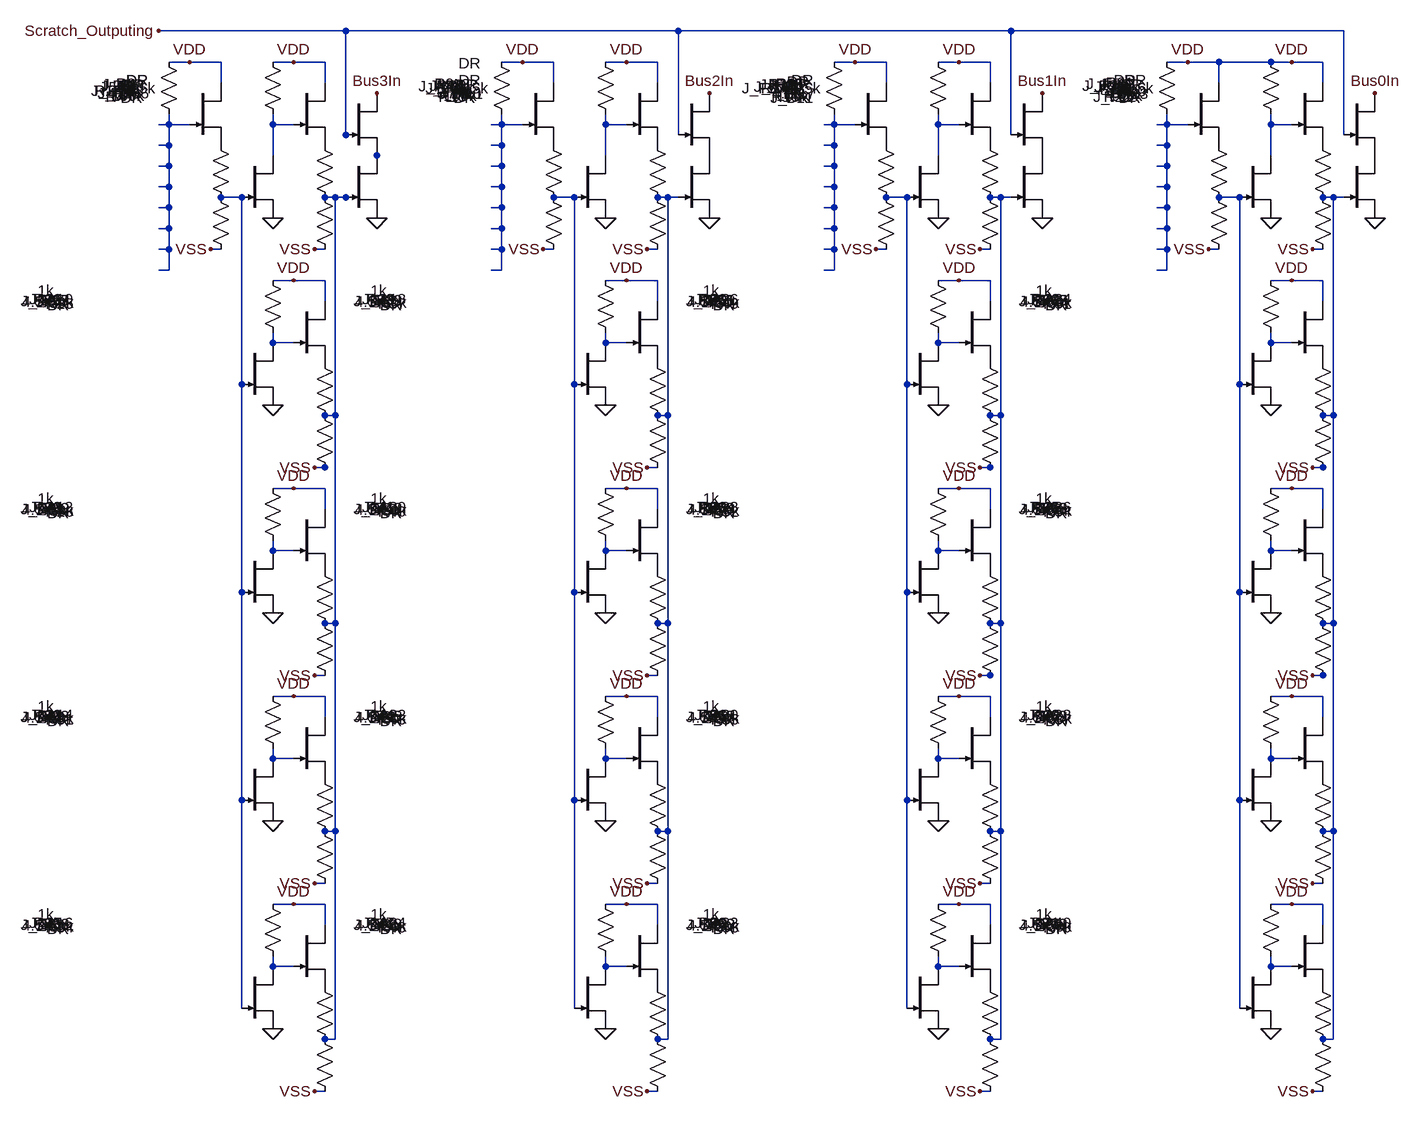
[diagram p0: schematic Bus1.asc]
Bus1.asc, the LTspice schematic file:
Version 4.1
SHEET 1 109444 42780
WIRE 40544 1168 40256 1168
WIRE 41056 1168 40544 1168
WIRE 41568 1168 41056 1168
WIRE 42080 1168 41568 1168
WIRE 40304 1216 40272 1216
WIRE 40352 1216 40304 1216
WIRE 40464 1216 40432 1216
WIRE 40512 1216 40464 1216
WIRE 40816 1216 40784 1216
WIRE 40864 1216 40816 1216
WIRE 40976 1216 40944 1216
WIRE 41024 1216 40976 1216
WIRE 41328 1216 41296 1216
WIRE 41376 1216 41328 1216
WIRE 41488 1216 41456 1216
WIRE 41536 1216 41488 1216
WIRE 41840 1216 41808 1216
WIRE 41888 1216 41840 1216
WIRE 41968 1216 41888 1216
WIRE 42000 1216 41968 1216
WIRE 42048 1216 42000 1216
WIRE 40352 1248 40352 1216
WIRE 40512 1248 40512 1216
WIRE 40864 1248 40864 1216
WIRE 41024 1248 41024 1216
WIRE 41376 1248 41376 1216
WIRE 41536 1248 41536 1216
WIRE 41888 1248 41888 1216
WIRE 42048 1248 42048 1216
WIRE 40272 1312 40272 1296
WIRE 40272 1312 40256 1312
WIRE 40304 1312 40272 1312
WIRE 40432 1312 40432 1296
WIRE 40464 1312 40432 1312
WIRE 40784 1312 40784 1296
WIRE 40784 1312 40768 1312
WIRE 40816 1312 40784 1312
WIRE 40944 1312 40944 1296
WIRE 40976 1312 40944 1312
WIRE 41296 1312 41296 1296
WIRE 41296 1312 41280 1312
WIRE 41328 1312 41296 1312
WIRE 41456 1312 41456 1296
WIRE 41488 1312 41456 1312
WIRE 41808 1312 41808 1296
WIRE 41808 1312 41792 1312
WIRE 41840 1312 41808 1312
WIRE 41968 1312 41968 1296
WIRE 42000 1312 41968 1312
WIRE 40544 1328 40544 1168
WIRE 41056 1328 41056 1168
WIRE 41568 1328 41568 1168
WIRE 42080 1328 42080 1168
WIRE 40272 1344 40272 1312
WIRE 40272 1344 40256 1344
WIRE 40784 1344 40784 1312
WIRE 40784 1344 40768 1344
WIRE 41296 1344 41296 1312
WIRE 41296 1344 41280 1344
WIRE 41808 1344 41808 1312
WIRE 41808 1344 41792 1344
WIRE 40432 1360 40432 1312
WIRE 40944 1360 40944 1312
WIRE 41456 1360 41456 1312
WIRE 41968 1360 41968 1312
WIRE 40272 1376 40272 1344
WIRE 40272 1376 40256 1376
WIRE 40784 1376 40784 1344
WIRE 40784 1376 40768 1376
WIRE 41296 1376 41296 1344
WIRE 41296 1376 41280 1376
WIRE 41808 1376 41808 1344
WIRE 41808 1376 41792 1376
WIRE 40272 1408 40272 1376
WIRE 40272 1408 40256 1408
WIRE 40784 1408 40784 1376
WIRE 40784 1408 40768 1408
WIRE 41296 1408 41296 1376
WIRE 41296 1408 41280 1408
WIRE 41808 1408 41808 1376
WIRE 41808 1408 41792 1408
WIRE 40384 1424 40352 1424
WIRE 40528 1424 40512 1424
WIRE 40544 1424 40528 1424
WIRE 40896 1424 40864 1424
WIRE 41040 1424 41024 1424
WIRE 41056 1424 41040 1424
WIRE 41408 1424 41376 1424
WIRE 41552 1424 41536 1424
WIRE 41568 1424 41552 1424
WIRE 41920 1424 41888 1424
WIRE 42064 1424 42048 1424
WIRE 42080 1424 42064 1424
WIRE 40272 1440 40272 1408
WIRE 40272 1440 40256 1440
WIRE 40784 1440 40784 1408
WIRE 40784 1440 40768 1440
WIRE 41296 1440 41296 1408
WIRE 41296 1440 41280 1440
WIRE 41808 1440 41808 1408
WIRE 41808 1440 41792 1440
WIRE 40272 1472 40272 1440
WIRE 40272 1472 40256 1472
WIRE 40784 1472 40784 1440
WIRE 40784 1472 40768 1472
WIRE 41296 1472 41296 1440
WIRE 41296 1472 41280 1472
WIRE 41808 1472 41808 1440
WIRE 41808 1472 41792 1472
WIRE 40272 1504 40272 1472
WIRE 40272 1504 40256 1504
WIRE 40352 1504 40336 1504
WIRE 40512 1504 40496 1504
WIRE 40784 1504 40784 1472
WIRE 40784 1504 40768 1504
WIRE 40864 1504 40848 1504
WIRE 41024 1504 41008 1504
WIRE 41296 1504 41296 1472
WIRE 41296 1504 41280 1504
WIRE 41376 1504 41360 1504
WIRE 41536 1504 41520 1504
WIRE 41808 1504 41808 1472
WIRE 41808 1504 41792 1504
WIRE 41888 1504 41872 1504
WIRE 42048 1504 42032 1504
WIRE 40272 1536 40272 1504
WIRE 40272 1536 40256 1536
WIRE 40784 1536 40784 1504
WIRE 40784 1536 40768 1536
WIRE 41296 1536 41296 1504
WIRE 41296 1536 41280 1536
WIRE 41808 1536 41808 1504
WIRE 41808 1536 41792 1536
WIRE 40464 1552 40432 1552
WIRE 40512 1552 40464 1552
WIRE 40976 1552 40944 1552
WIRE 41024 1552 40976 1552
WIRE 41488 1552 41456 1552
WIRE 41536 1552 41488 1552
WIRE 42000 1552 41968 1552
WIRE 42048 1552 42000 1552
WIRE 40512 1584 40512 1552
WIRE 41024 1584 41024 1552
WIRE 41536 1584 41536 1552
WIRE 42048 1584 42048 1552
WIRE 40432 1648 40432 1632
WIRE 40464 1648 40432 1648
WIRE 40944 1648 40944 1632
WIRE 40976 1648 40944 1648
WIRE 41456 1648 41456 1632
WIRE 41488 1648 41456 1648
WIRE 41968 1648 41968 1632
WIRE 42000 1648 41968 1648
WIRE 40384 1712 40384 1424
WIRE 40896 1712 40896 1424
WIRE 41408 1712 41408 1424
WIRE 41920 1712 41920 1424
WIRE 40528 1760 40528 1424
WIRE 40528 1760 40512 1760
WIRE 41040 1760 41040 1424
WIRE 41040 1760 41024 1760
WIRE 41552 1760 41552 1424
WIRE 41552 1760 41536 1760
WIRE 42064 1760 42064 1424
WIRE 42064 1760 42048 1760
WIRE 40512 1840 40496 1840
WIRE 41024 1840 41008 1840
WIRE 41536 1840 41520 1840
WIRE 42048 1840 42032 1840
WIRE 40464 1872 40432 1872
WIRE 40512 1872 40464 1872
WIRE 40976 1872 40944 1872
WIRE 41024 1872 40976 1872
WIRE 41488 1872 41456 1872
WIRE 41536 1872 41488 1872
WIRE 42000 1872 41968 1872
WIRE 42048 1872 42000 1872
WIRE 40512 1904 40512 1872
WIRE 41024 1904 41024 1872
WIRE 41536 1904 41536 1872
WIRE 42048 1904 42048 1872
WIRE 40432 1968 40432 1952
WIRE 40464 1968 40432 1968
WIRE 40944 1968 40944 1952
WIRE 40976 1968 40944 1968
WIRE 41456 1968 41456 1952
WIRE 41488 1968 41456 1968
WIRE 41968 1968 41968 1952
WIRE 42000 1968 41968 1968
WIRE 40384 2032 40384 1712
WIRE 40896 2032 40896 1712
WIRE 41408 2032 41408 1712
WIRE 41920 2032 41920 1712
WIRE 40528 2080 40528 1760
WIRE 40528 2080 40512 2080
WIRE 41040 2080 41040 1760
WIRE 41040 2080 41024 2080
WIRE 41552 2080 41552 1760
WIRE 41552 2080 41536 2080
WIRE 42064 2080 42064 1760
WIRE 42064 2080 42048 2080
WIRE 40512 2160 40496 2160
WIRE 41024 2160 41008 2160
WIRE 41536 2160 41520 2160
WIRE 42048 2160 42032 2160
WIRE 40464 2192 40432 2192
WIRE 40512 2192 40464 2192
WIRE 40976 2192 40944 2192
WIRE 41024 2192 40976 2192
WIRE 41488 2192 41456 2192
WIRE 41536 2192 41488 2192
WIRE 42000 2192 41968 2192
WIRE 42048 2192 42000 2192
WIRE 40512 2224 40512 2192
WIRE 41024 2224 41024 2192
WIRE 41536 2224 41536 2192
WIRE 42048 2224 42048 2192
WIRE 40432 2288 40432 2272
WIRE 40464 2288 40432 2288
WIRE 40944 2288 40944 2272
WIRE 40976 2288 40944 2288
WIRE 41456 2288 41456 2272
WIRE 41488 2288 41456 2288
WIRE 41968 2288 41968 2272
WIRE 42000 2288 41968 2288
WIRE 40384 2352 40384 2032
WIRE 40896 2352 40896 2032
WIRE 41408 2352 41408 2032
WIRE 41920 2352 41920 2032
WIRE 40528 2400 40528 2080
WIRE 40528 2400 40512 2400
WIRE 41040 2400 41040 2080
WIRE 41040 2400 41024 2400
WIRE 41552 2400 41552 2080
WIRE 41552 2400 41536 2400
WIRE 42064 2400 42064 2080
WIRE 42064 2400 42048 2400
WIRE 40512 2480 40496 2480
WIRE 41024 2480 41008 2480
WIRE 41536 2480 41520 2480
WIRE 42048 2480 42032 2480
WIRE 40464 2512 40432 2512
WIRE 40512 2512 40464 2512
WIRE 40976 2512 40944 2512
WIRE 41024 2512 40976 2512
WIRE 41488 2512 41456 2512
WIRE 41536 2512 41488 2512
WIRE 42000 2512 41968 2512
WIRE 42048 2512 42000 2512
WIRE 40512 2544 40512 2512
WIRE 41024 2544 41024 2512
WIRE 41536 2544 41536 2512
WIRE 42048 2544 42048 2512
WIRE 40432 2608 40432 2592
WIRE 40464 2608 40432 2608
WIRE 40944 2608 40944 2592
WIRE 40976 2608 40944 2608
WIRE 41456 2608 41456 2592
WIRE 41488 2608 41456 2608
WIRE 41968 2608 41968 2592
WIRE 42000 2608 41968 2608
WIRE 40384 2672 40384 2352
WIRE 40896 2672 40896 2352
WIRE 41408 2672 41408 2352
WIRE 41920 2672 41920 2352
WIRE 40528 2720 40528 2400
WIRE 40528 2720 40512 2720
WIRE 41040 2720 41040 2400
WIRE 41040 2720 41024 2720
WIRE 41552 2720 41552 2400
WIRE 41552 2720 41536 2720
WIRE 42064 2720 42064 2400
WIRE 42064 2720 42048 2720
WIRE 40512 2800 40496 2800
WIRE 41024 2800 41008 2800
WIRE 41536 2800 41520 2800
WIRE 42048 2800 42032 2800
FLAG 40256 1168 Scratch_Outputing
FLAG 40304 1216 VDD
FLAG 40464 1216 VDD
FLAG 40336 1504 VSS
FLAG 40496 1504 VSS
FLAG 40432 1456 0
FLAG 40592 1456 0
FLAG 40816 1216 VDD
FLAG 40976 1216 VDD
FLAG 40848 1504 VSS
FLAG 41008 1504 VSS
FLAG 40944 1456 0
FLAG 41104 1456 0
FLAG 41328 1216 VDD
FLAG 41488 1216 VDD
FLAG 41360 1504 VSS
FLAG 41520 1504 VSS
FLAG 41456 1456 0
FLAG 41616 1456 0
FLAG 41840 1216 VDD
FLAG 42000 1216 VDD
FLAG 41872 1504 VSS
FLAG 42032 1504 VSS
FLAG 41968 1456 0
FLAG 42128 1456 0
FLAG 40592 1264 Bus3In
FLAG 41104 1264 Bus2In
FLAG 41616 1264 Bus1In
FLAG 42128 1264 Bus0In
FLAG 40464 1552 VDD
FLAG 40496 1840 VSS
FLAG 40432 1744 0
FLAG 40464 1872 VDD
FLAG 40496 2160 VSS
FLAG 40432 2064 0
FLAG 40464 2192 VDD
FLAG 40496 2480 VSS
FLAG 40432 2384 0
FLAG 40464 2512 VDD
FLAG 40496 2800 VSS
FLAG 40432 2704 0
FLAG 40976 1552 VDD
FLAG 41008 1840 VSS
FLAG 40944 1744 0
FLAG 40976 1872 VDD
FLAG 41008 2160 VSS
FLAG 40944 2064 0
FLAG 40976 2192 VDD
FLAG 41008 2480 VSS
FLAG 40944 2384 0
FLAG 40976 2512 VDD
FLAG 41008 2800 VSS
FLAG 40944 2704 0
FLAG 41488 1552 VDD
FLAG 41520 1840 VSS
FLAG 41456 1744 0
FLAG 41488 1872 VDD
FLAG 41520 2160 VSS
FLAG 41456 2064 0
FLAG 41488 2192 VDD
FLAG 41520 2480 VSS
FLAG 41456 2384 0
FLAG 41488 2512 VDD
FLAG 41520 2800 VSS
FLAG 41456 2704 0
FLAG 42000 1552 VDD
FLAG 42032 1840 VSS
FLAG 41968 1744 0
FLAG 42000 1872 VDD
FLAG 42032 2160 VSS
FLAG 41968 2064 0
FLAG 42000 2192 VDD
FLAG 42032 2480 VSS
FLAG 41968 2384 0
FLAG 42000 2512 VDD
FLAG 42032 2800 VSS
FLAG 41968 2704 0
SYMBOL njf 40544 1360 R0
WINDOW 0 -376 -108 Left 2
WINDOW 3 -338 -116 Left 2
SYMATTR InstName J_F59
SYMATTR Value DR
SYMBOL njf 40544 1264 R0
WINDOW 0 -382 0 Left 2
WINDOW 3 -360 4 Left 2
SYMATTR InstName J_F266
SYMATTR Value DR
SYMBOL res 40528 1856 R180
WINDOW 0 408 274 Left 2
WINDOW 3 436 271 Left 2
SYMATTR InstName R93
SYMATTR Value 4.5k
SYMBOL njf 40384 1968 R0
WINDOW 0 -340 -64 Left 2
WINDOW 3 -315 -65 Left 2
SYMATTR InstName J_A94
SYMATTR Value DR
SYMBOL njf 40384 2288 R0
WINDOW 0 -340 -64 Left 2
WINDOW 3 -315 -65 Left 2
SYMATTR InstName J_A98
SYMATTR Value DR
SYMBOL res 41552 1856 R180
WINDOW 0 408 274 Left 2
WINDOW 3 436 271 Left 2
SYMATTR InstName R955
SYMATTR Value 4.5k
SYMBOL res 41552 2176 R180
WINDOW 0 408 274 Left 2
WINDOW 3 436 271 Left 2
SYMATTR InstName R958
SYMATTR Value 4.5k
SYMBOL res 42064 1856 R180
WINDOW 0 408 274 Left 2
WINDOW 3 436 271 Left 2
SYMATTR InstName R967
SYMATTR Value 4.5k
SYMBOL res 42064 2176 R180
WINDOW 0 408 274 Left 2
WINDOW 3 436 271 Left 2
SYMATTR InstName R970
SYMATTR Value 4.5k
SYMBOL res 40256 1200 R0
WINDOW 0 -99 60 Left 2
WINDOW 3 -73 68 Left 2
SYMATTR InstName R1
SYMATTR Value 100k
SYMBOL njf 40304 1248 R0
WINDOW 0 -152 12 Left 2
WINDOW 3 -106 23 Left 2
SYMATTR InstName J_F1
SYMATTR Value DR
SYMBOL res 40336 1328 R0
WINDOW 0 -139 -67 Left 2
WINDOW 3 -141 -74 Left 2
SYMATTR InstName R2
SYMATTR Value 1k
SYMBOL res 40336 1408 R0
WINDOW 0 -145 -159 Left 2
WINDOW 3 -159 -144 Left 2
SYMATTR InstName R3
SYMATTR Value 4.8k
SYMBOL njf 40384 1360 R0
WINDOW 0 -215 -110 Left 2
WINDOW 3 -183 -109 Left 2
SYMATTR InstName J_A1
SYMATTR Value DR
SYMBOL res 40416 1200 R0
WINDOW 0 -241 69 Left 2
WINDOW 3 -237 55 Left 2
SYMATTR InstName R4
SYMATTR Value 50k
SYMBOL njf 40464 1248 R0
WINDOW 0 -299 7 Left 2
WINDOW 3 -270 17 Left 2
SYMATTR InstName J_A2
SYMATTR Value DR
SYMBOL res 40496 1328 R0
WINDOW 0 -308 -67 Left 2
WINDOW 3 -292 -72 Left 2
SYMATTR InstName R5
SYMATTR Value 1k
SYMBOL res 40528 1520 R180
WINDOW 0 312 268 Left 2
WINDOW 3 276 264 Left 2
SYMATTR InstName R6
SYMATTR Value 4.5k
SYMBOL njf 40544 1360 R0
WINDOW 0 -376 -108 Left 2
WINDOW 3 -338 -116 Left 2
SYMATTR InstName J_F2
SYMATTR Value DR
SYMBOL res 40768 1200 R0
WINDOW 0 -84 62 Left 2
WINDOW 3 -73 68 Left 2
SYMATTR InstName R7
SYMATTR Value 100k
SYMBOL njf 40816 1248 R0
WINDOW 0 -149 8 Left 2
WINDOW 3 -106 23 Left 2
SYMATTR InstName J_F3
SYMATTR Value DR
SYMBOL res 40848 1328 R0
WINDOW 0 -139 -67 Left 2
WINDOW 3 -141 -74 Left 2
SYMATTR InstName R8
SYMATTR Value 1k
SYMBOL res 40848 1408 R0
WINDOW 0 -167 -159 Left 2
WINDOW 3 -159 -144 Left 2
SYMATTR InstName R9
SYMATTR Value 4.8k
SYMBOL njf 40896 1360 R0
WINDOW 0 -215 -110 Left 2
WINDOW 3 -183 -109 Left 2
SYMATTR InstName J_A3
SYMATTR Value DR
SYMBOL res 40928 1200 R0
WINDOW 0 -241 69 Left 2
WINDOW 3 -237 55 Left 2
SYMATTR InstName R10
SYMATTR Value 50k
SYMBOL njf 40976 1248 R0
WINDOW 0 -320 5 Left 2
WINDOW 3 -270 17 Left 2
SYMATTR InstName J_A4
SYMATTR Value DR
SYMBOL res 41008 1328 R0
WINDOW 0 -296 -63 Left 2
WINDOW 3 -292 -72 Left 2
SYMATTR InstName R11
SYMATTR Value 1k
SYMBOL res 41040 1520 R180
WINDOW 0 312 268 Left 2
WINDOW 3 276 264 Left 2
SYMATTR InstName R12
SYMATTR Value 4.5k
SYMBOL njf 41056 1360 R0
WINDOW 0 -383 -108 Left 2
WINDOW 3 -338 -116 Left 2
SYMATTR InstName J_F4
SYMATTR Value DR
SYMBOL res 41280 1200 R0
WINDOW 0 -85 50 Left 2
WINDOW 3 -73 68 Left 2
SYMATTR InstName R13
SYMATTR Value 100k
SYMBOL njf 41328 1248 R0
WINDOW 0 -174 8 Left 2
WINDOW 3 -106 23 Left 2
SYMATTR InstName J_F5
SYMATTR Value DR
SYMBOL res 41360 1328 R0
WINDOW 0 -177 -72 Left 2
WINDOW 3 -141 -74 Left 2
SYMATTR InstName R14
SYMATTR Value 1k
SYMBOL res 41360 1408 R0
WINDOW 0 -154 -159 Left 2
WINDOW 3 -159 -144 Left 2
SYMATTR InstName R15
SYMATTR Value 4.8k
SYMBOL njf 41408 1360 R0
WINDOW 0 -215 -110 Left 2
WINDOW 3 -183 -109 Left 2
SYMATTR InstName J_A5
SYMATTR Value DR
SYMBOL res 41440 1200 R0
WINDOW 0 -241 69 Left 2
WINDOW 3 -237 55 Left 2
SYMATTR InstName R16
SYMATTR Value 50k
SYMBOL njf 41488 1248 R0
WINDOW 0 -316 6 Left 2
WINDOW 3 -270 17 Left 2
SYMATTR InstName J_A6
SYMATTR Value DR
SYMBOL res 41520 1328 R0
WINDOW 0 -296 -63 Left 2
WINDOW 3 -292 -72 Left 2
SYMATTR InstName R17
SYMATTR Value 1k
SYMBOL res 41552 1520 R180
WINDOW 0 312 268 Left 2
WINDOW 3 276 264 Left 2
SYMATTR InstName R18
SYMATTR Value 4.5k
SYMBOL njf 41568 1360 R0
WINDOW 0 -387 -109 Left 2
WINDOW 3 -338 -116 Left 2
SYMATTR InstName J_F6
SYMATTR Value DR
SYMBOL res 41792 1200 R0
WINDOW 0 -87 58 Left 2
WINDOW 3 -73 68 Left 2
SYMATTR InstName R19
SYMATTR Value 100k
SYMBOL njf 41840 1248 R0
WINDOW 0 -162 4 Left 2
WINDOW 3 -106 23 Left 2
SYMATTR InstName J_F7
SYMATTR Value DR
SYMBOL res 41872 1328 R0
WINDOW 0 -139 -67 Left 2
WINDOW 3 -141 -74 Left 2
SYMATTR InstName R20
SYMATTR Value 1k
SYMBOL res 41872 1408 R0
WINDOW 0 -158 -160 Left 2
WINDOW 3 -159 -144 Left 2
SYMATTR InstName R21
SYMATTR Value 4.8k
SYMBOL njf 41920 1360 R0
WINDOW 0 -215 -110 Left 2
WINDOW 3 -183 -109 Left 2
SYMATTR InstName J_A7
SYMATTR Value DR
SYMBOL res 41952 1200 R0
WINDOW 0 -241 69 Left 2
WINDOW 3 -237 55 Left 2
SYMATTR InstName R22
SYMATTR Value 50k
SYMBOL njf 42000 1248 R0
WINDOW 0 -304 6 Left 2
WINDOW 3 -270 17 Left 2
SYMATTR InstName J_A8
SYMATTR Value DR
SYMBOL res 42032 1328 R0
WINDOW 0 -296 -63 Left 2
WINDOW 3 -292 -72 Left 2
SYMATTR InstName R23
SYMATTR Value 1k
SYMBOL res 42064 1520 R180
WINDOW 0 312 268 Left 2
WINDOW 3 276 264 Left 2
SYMATTR InstName R24
SYMATTR Value 4.5k
SYMBOL njf 42080 1360 R0
WINDOW 0 -396 -111 Left 2
WINDOW 3 -338 -116 Left 2
SYMATTR InstName J_F8
SYMATTR Value DR
SYMBOL njf 40544 1264 R0
WINDOW 0 -382 0 Left 2
WINDOW 3 -360 4 Left 2
SYMATTR InstName J_F9
SYMATTR Value DR
SYMBOL njf 41056 1264 R0
WINDOW 0 -369 1 Left 2
WINDOW 3 -338 -46 Left 2
SYMATTR InstName J_F10
SYMATTR Value DR
SYMBOL njf 41568 1264 R0
WINDOW 0 -370 7 Left 2
WINDOW 3 -345 -18 Left 2
SYMATTR InstName J_F11
SYMATTR Value DR
SYMBOL njf 42080 1264 R0
WINDOW 0 -385 5 Left 2
WINDOW 3 -354 -20 Left 2
SYMATTR InstName J_F12
SYMATTR Value DR
SYMBOL njf 40384 1648 R0
WINDOW 0 -340 -64 Left 2
WINDOW 3 -315 -65 Left 2
SYMATTR InstName J_A9
SYMATTR Value DR
SYMBOL res 40416 1536 R0
WINDOW 0 -334 52 Left 2
WINDOW 3 -328 50 Left 2
SYMATTR InstName R25
SYMATTR Value 50k
SYMBOL njf 40464 1584 R0
WINDOW 0 -407 -3 Left 2
WINDOW 3 -379 6 Left 2
SYMATTR InstName J_A10
SYMATTR Value DR
SYMBOL res 40496 1664 R0
WINDOW 0 -432 -83 Left 2
WINDOW 3 -426 -96 Left 2
SYMATTR InstName R26
SYMATTR Value 1k
SYMBOL res 40528 1856 R180
WINDOW 0 408 274 Left 2
WINDOW 3 436 271 Left 2
SYMATTR InstName R27
SYMATTR Value 4.5k
SYMBOL njf 40384 1968 R0
WINDOW 0 -340 -64 Left 2
WINDOW 3 -315 -65 Left 2
SYMATTR InstName J_A11
SYMATTR Value DR
SYMBOL res 40416 1856 R0
WINDOW 0 -334 52 Left 2
WINDOW 3 -328 50 Left 2
SYMATTR InstName R28
SYMATTR Value 50k
SYMBOL njf 40464 1904 R0
WINDOW 0 -407 -3 Left 2
WINDOW 3 -379 6 Left 2
SYMATTR InstName J_A12
SYMATTR Value DR
SYMBOL res 40496 1984 R0
WINDOW 0 -432 -83 Left 2
WINDOW 3 -426 -96 Left 2
SYMATTR InstName R29
SYMATTR Value 1k
SYMBOL res 40528 2176 R180
WINDOW 0 408 274 Left 2
WINDOW 3 436 271 Left 2
SYMATTR InstName R30
SYMATTR Value 4.5k
SYMBOL njf 40384 2288 R0
WINDOW 0 -340 -64 Left 2
WINDOW 3 -315 -65 Left 2
SYMATTR InstName J_A13
SYMATTR Value DR
SYMBOL res 40416 2176 R0
WINDOW 0 -334 52 Left 2
WINDOW 3 -328 50 Left 2
SYMATTR InstName R31
SYMATTR Value 50k
SYMBOL njf 40464 2224 R0
WINDOW 0 -407 -3 Left 2
WINDOW 3 -379 6 Left 2
SYMATTR InstName J_A14
SYMATTR Value DR
SYMBOL res 40496 2304 R0
WINDOW 0 -432 -83 Left 2
WINDOW 3 -426 -96 Left 2
SYMATTR InstName R32
SYMATTR Value 1k
SYMBOL res 40528 2496 R180
WINDOW 0 408 274 Left 2
WINDOW 3 436 271 Left 2
SYMATTR InstName R33
SYMATTR Value 4.5k
SYMBOL njf 40384 2608 R0
WINDOW 0 -340 -64 Left 2
WINDOW 3 -315 -65 Left 2
SYMATTR InstName J_A15
SYMATTR Value DR
SYMBOL res 40416 2496 R0
WINDOW 0 -334 52 Left 2
WINDOW 3 -328 50 Left 2
SYMATTR InstName R34
SYMATTR Value 50k
SYMBOL njf 40464 2544 R0
WINDOW 0 -407 -3 Left 2
WINDOW 3 -379 6 Left 2
SYMATTR InstName J_A16
SYMATTR Value DR
SYMBOL res 40496 2624 R0
WINDOW 0 -432 -83 Left 2
WINDOW 3 -426 -96 Left 2
SYMATTR InstName R35
SYMATTR Value 1k
SYMBOL res 40528 2816 R180
WINDOW 0 408 274 Left 2
WINDOW 3 436 271 Left 2
SYMATTR InstName R36
SYMATTR Value 4.5k
SYMBOL njf 40896 1648 R0
WINDOW 0 -340 -64 Left 2
WINDOW 3 -315 -65 Left 2
SYMATTR InstName J_A17
SYMATTR Value DR
SYMBOL res 40928 1536 R0
WINDOW 0 -334 52 Left 2
WINDOW 3 -328 50 Left 2
SYMATTR InstName R37
SYMATTR Value 50k
SYMBOL njf 40976 1584 R0
WINDOW 0 -407 -3 Left 2
WINDOW 3 -379 6 Left 2
SYMATTR InstName J_A18
SYMATTR Value DR
SYMBOL res 41008 1664 R0
WINDOW 0 -432 -83 Left 2
WINDOW 3 -426 -96 Left 2
SYMATTR InstName R38
SYMATTR Value 1k
SYMBOL res 41040 1856 R180
WINDOW 0 408 274 Left 2
WINDOW 3 436 271 Left 2
SYMATTR InstName R39
SYMATTR Value 4.5k
SYMBOL njf 40896 1968 R0
WINDOW 0 -340 -64 Left 2
WINDOW 3 -315 -65 Left 2
SYMATTR InstName J_A19
SYMATTR Value DR
SYMBOL res 40928 1856 R0
WINDOW 0 -334 52 Left 2
WINDOW 3 -328 50 Left 2
SYMATTR InstName R40
SYMATTR Value 50k
SYMBOL njf 40976 1904 R0
WINDOW 0 -407 -3 Left 2
WINDOW 3 -379 6 Left 2
SYMATTR InstName J_A20
SYMATTR Value DR
SYMBOL res 41008 1984 R0
WINDOW 0 -432 -83 Left 2
WINDOW 3 -426 -96 Left 2
SYMATTR InstName R41
SYMATTR Value 1k
SYMBOL res 41040 2176 R180
WINDOW 0 408 274 Left 2
WINDOW 3 436 271 Left 2
SYMATTR InstName R42
SYMATTR Value 4.5k
SYMBOL njf 40896 2288 R0
WINDOW 0 -340 -64 Left 2
WINDOW 3 -315 -65 Left 2
SYMATTR InstName J_A21
SYMATTR Value DR
SYMBOL res 40928 2176 R0
WINDOW 0 -334 52 Left 2
WINDOW 3 -328 50 Left 2
SYMATTR InstName R43
SYMATTR Value 50k
SYMBOL njf 40976 2224 R0
WINDOW 0 -407 -3 Left 2
WINDOW 3 -379 6 Left 2
SYMATTR InstName J_A22
SYMATTR Value DR
SYMBOL res 41008 2304 R0
WINDOW 0 -432 -83 Left 2
WINDOW 3 -426 -96 Left 2
SYMATTR InstName R44
SYMATTR Value 1k
SYMBOL res 41040 2496 R180
WINDOW 0 408 274 Left 2
WINDOW 3 436 271 Left 2
SYMATTR InstName R45
SYMATTR Value 4.5k
SYMBOL njf 40896 2608 R0
WINDOW 0 -340 -64 Left 2
WINDOW 3 -315 -65 Left 2
SYMATTR InstName J_A23
SYMATTR Value DR
SYMBOL res 40928 2496 R0
WINDOW 0 -334 52 Left 2
WINDOW 3 -328 50 Left 2
SYMATTR InstName R46
SYMATTR Value 50k
SYMBOL njf 40976 2544 R0
WINDOW 0 -407 -3 Left 2
WINDOW 3 -379 6 Left 2
SYMATTR InstName J_A24
SYMATTR Value DR
SYMBOL res 41008 2624 R0
WINDOW 0 -432 -83 Left 2
WINDOW 3 -426 -96 Left 2
SYMATTR InstName R47
SYMATTR Value 1k
SYMBOL res 41040 2816 R180
WINDOW 0 408 274 Left 2
WINDOW 3 436 271 Left 2
SYMATTR InstName R48
SYMATTR Value 4.5k
SYMBOL njf 41408 1648 R0
WINDOW 0 -340 -64 Left 2
WINDOW 3 -315 -65 Left 2
SYMATTR InstName J_A25
SYMATTR Value DR
SYMBOL res 41440 1536 R0
WINDOW 0 -334 52 Left 2
WINDOW 3 -328 50 Left 2
SYMATTR InstName R49
SYMATTR Value 50k
SYMBOL njf 41488 1584 R0
WINDOW 0 -407 -3 Left 2
WINDOW 3 -379 6 Left 2
SYMATTR InstName J_A26
SYMATTR Value DR
SYMBOL res 41520 1664 R0
WINDOW 0 -432 -83 Left 2
WINDOW 3 -426 -96 Left 2
SYMATTR InstName R50
SYMATTR Value 1k
SYMBOL res 41552 1856 R180
WINDOW 0 408 274 Left 2
WINDOW 3 436 271 Left 2
SYMATTR InstName R51
SYMATTR Value 4.5k
SYMBOL njf 41408 1968 R0
WINDOW 0 -340 -64 Left 2
WINDOW 3 -315 -65 Left 2
SYMATTR InstName J_A27
SYMATTR Value DR
SYMBOL res 41440 1856 R0
WINDOW 0 -334 52 Left 2
WINDOW 3 -328 50 Left 2
SYMATTR InstName R52
SYMATTR Value 50k
SYMBOL njf 41488 1904 R0
WINDOW 0 -407 -3 Left 2
WINDOW 3 -379 6 Left 2
SYMATTR InstName J_A28
SYMATTR Value DR
SYMBOL res 41520 1984 R0
WINDOW 0 -432 -83 Left 2
WINDOW 3 -426 -96 Left 2
SYMATTR InstName R53
SYMATTR Value 1k
SYMBOL res 41552 2176 R180
WINDOW 0 408 274 Left 2
WINDOW 3 436 271 Left 2
SYMATTR InstName R54
SYMATTR Value 4.5k
SYMBOL njf 41408 2288 R0
WINDOW 0 -340 -64 Left 2
WINDOW 3 -315 -65 Left 2
SYMATTR InstName J_A29
SYMATTR Value DR
SYMBOL res 41440 2176 R0
WINDOW 0 -334 52 Left 2
WINDOW 3 -328 50 Left 2
SYMATTR InstName R55
SYMATTR Value 50k
SYMBOL njf 41488 2224 R0
WINDOW 0 -407 -3 Left 2
WINDOW 3 -379 6 Left 2
SYMATTR InstName J_A30
SYMATTR Value DR
SYMBOL res 41520 2304 R0
WINDOW 0 -432 -83 Left 2
WINDOW 3 -426 -96 Left 2
SYMATTR InstName R56
SYMATTR Value 1k
SYMBOL res 41552 2496 R180
WINDOW 0 408 274 Left 2
WINDOW 3 436 271 Left 2
SYMATTR InstName R57
SYMATTR Value 4.5k
SYMBOL njf 41408 2608 R0
WINDOW 0 -340 -64 Left 2
WINDOW 3 -315 -65 Left 2
SYMATTR InstName J_A31
SYMATTR Value DR
SYMBOL res 41440 2496 R0
WINDOW 0 -334 52 Left 2
WINDOW 3 -328 50 Left 2
SYMATTR InstName R58
SYMATTR Value 50k
SYMBOL njf 41488 2544 R0
WINDOW 0 -407 -3 Left 2
WINDOW 3 -379 6 Left 2
SYMATTR InstName J_A32
SYMATTR Value DR
SYMBOL res 41520 2624 R0
WINDOW 0 -432 -83 Left 2
WINDOW 3 -426 -96 Left 2
SYMATTR InstName R59
SYMATTR Value 1k
SYMBOL res 41552 2816 R180
WINDOW 0 408 274 Left 2
WINDOW 3 436 271 Left 2
SYMATTR InstName R60
SYMATTR Value 4.5k
SYMBOL njf 41920 1648 R0
WINDOW 0 -340 -64 Left 2
WINDOW 3 -315 -65 Left 2
SYMATTR InstName J_A33
SYMATTR Value DR
SYMBOL res 41952 1536 R0
WINDOW 0 -334 52 Left 2
WINDOW 3 -328 50 Left 2
SYMATTR InstName R61
SYMATTR Value 50k
SYMBOL njf 42000 1584 R0
WINDOW 0 -407 -3 Left 2
WINDOW 3 -379 6 Left 2
SYMATTR InstName J_A34
SYMATTR Value DR
SYMBOL res 42032 1664 R0
WINDOW 0 -432 -83 Left 2
WINDOW 3 -426 -96 Left 2
SYMATTR InstName R62
SYMATTR Value 1k
SYMBOL res 42064 1856 R180
WINDOW 0 408 274 Left 2
WINDOW 3 436 271 Left 2
SYMATTR InstName R63
SYMATTR Value 4.5k
SYMBOL njf 41920 1968 R0
WINDOW 0 -340 -64 Left 2
WINDOW 3 -315 -65 Left 2
SYMATTR InstName J_A35
SYMATTR Value DR
SYMBOL res 41952 1856 R0
WINDOW 0 -334 52 Left 2
WINDOW 3 -328 50 Left 2
SYMATTR InstName R64
SYMATTR Value 50k
SYMBOL njf 42000 1904 R0
WINDOW 0 -407 -3 Left 2
WINDOW 3 -379 6 Left 2
SYMATTR InstName J_A36
SYMATTR Value DR
SYMBOL res 42032 1984 R0
WINDOW 0 -432 -83 Left 2
WINDOW 3 -426 -96 Left 2
SYMATTR InstName R65
SYMATTR Value 1k
SYMBOL res 42064 2176 R180
WINDOW 0 408 274 Left 2
WINDOW 3 436 271 Left 2
SYMATTR InstName R66
SYMATTR Value 4.5k
SYMBOL njf 41920 2288 R0
WINDOW 0 -340 -64 Left 2
WINDOW 3 -315 -65 Left 2
SYMATTR InstName J_A37
SYMATTR Value DR
SYMBOL res 41952 2176 R0
WINDOW 0 -334 52 Left 2
WINDOW 3 -328 50 Left 2
SYMATTR InstName R67
SYMATTR Value 50k
SYMBOL njf 42000 2224 R0
WINDOW 0 -407 -3 Left 2
WINDOW 3 -379 6 Left 2
SYMATTR InstName J_A38
SYMATTR Value DR
SYMBOL res 42032 2304 R0
WINDOW 0 -432 -83 Left 2
WINDOW 3 -426 -96 Left 2
SYMATTR InstName R68
SYMATTR Value 1k
SYMBOL res 42064 2496 R180
WINDOW 0 408 274 Left 2
WINDOW 3 436 271 Left 2
SYMATTR InstName R69
SYMATTR Value 4.5k
SYMBOL njf 41920 2608 R0
WINDOW 0 -340 -64 Left 2
WINDOW 3 -315 -65 Left 2
SYMATTR InstName J_A39
SYMATTR Value DR
SYMBOL res 41952 2496 R0
WINDOW 0 -334 52 Left 2
WINDOW 3 -328 50 Left 2
SYMATTR InstName R70
SYMATTR Value 50k
SYMBOL njf 42000 2544 R0
WINDOW 0 -407 -3 Left 2
WINDOW 3 -379 6 Left 2
SYMATTR InstName J_A40
SYMATTR Value DR
SYMBOL res 42032 2624 R0
WINDOW 0 -432 -83 Left 2
WINDOW 3 -426 -96 Left 2
SYMATTR InstName R71
SYMATTR Value 1k
SYMBOL res 42064 2816 R180
WINDOW 0 408 274 Left 2
WINDOW 3 436 271 Left 2
SYMATTR InstName R72
SYMATTR Value 4.5k

The netlist it stands for:
* Bus1.asc
J_F59 P001 N010 0 DR
J_F266 Bus3In Scratch_Outputing P001 DR
R93 VSS N010 4.5k
J_A94 N021 N009 0 DR
J_A98 N025 N009 0 DR
R955 VSS N014 4.5k
R958 VSS N014 4.5k
R967 VSS N016 4.5k
R970 VSS N016 4.5k
R1 VDD N001 100k
J_F1 VDD N001 P002 DR
R2 P002 N009 1k
R3 N009 VSS 4.8k
J_A1 N002 N009 0 DR
R4 VDD N002 50k
J_A2 VDD N002 P003 DR
R5 P003 N010 1k
R6 VSS N010 4.5k
J_F2 P001 N010 0 DR
R7 VDD N003 100k
J_F3 VDD N003 P004 DR
R8 P004 N011 1k
R9 N011 VSS 4.8k
J_A3 N004 N011 0 DR
R10 VDD N004 50k
J_A4 VDD N004 P005 DR
R11 P005 N012 1k
R12 VSS N012 4.5k
J_F4 P006 N012 0 DR
R13 VDD N005 100k
J_F5 VDD N005 P007 DR
R14 P007 N013 1k
R15 N013 VSS 4.8k
J_A5 N006 N013 0 DR
R16 VDD N006 50k
J_A6 VDD N006 P008 DR
R17 P008 N014 1k
R18 VSS N014 4.5k
J_F6 P009 N014 0 DR
R19 VDD N007 100k
J_F7 VDD N007 P010 DR
R20 P010 N015 1k
R21 N015 VSS 4.8k
J_A7 N008 N015 0 DR
R22 VDD N008 50k
J_A8 VDD N008 P011 DR
R23 P011 N016 1k
R24 VSS N016 4.5k
J_F8 P012 N016 0 DR
J_F9 Bus3In Scratch_Outputing P001 DR
J_F10 Bus2In Scratch_Outputing P006 DR
J_F11 Bus1In Scratch_Outputing P009 DR
J_F12 Bus0In Scratch_Outputing P012 DR
J_A9 N017 N009 0 DR
R25 VDD N017 50k
J_A10 VDD N017 P013 DR
R26 P013 N010 1k
R27 VSS N010 4.5k
J_A11 N021 N009 0 DR
R28 VDD N021 50k
J_A12 VDD N021 P014 DR
R29 P014 N010 1k
R30 VSS N010 4.5k
J_A13 N025 N009 0 DR
R31 VDD N025 50k
J_A14 VDD N025 P015 DR
R32 P015 N010 1k
R33 VSS N010 4.5k
J_A15 N029 N009 0 DR
R34 VDD N029 50k
J_A16 VDD N029 P016 DR
R35 P016 N010 1k
R36 VSS N010 4.5k
J_A17 N018 N011 0 DR
R37 VDD N018 50k
J_A18 VDD N018 P017 DR
R38 P017 N012 1k
R39 VSS N012 4.5k
J_A19 N022 N011 0 DR
R40 VDD N022 50k
J_A20 VDD N022 P018 DR
R41 P018 N012 1k
R42 VSS N012 4.5k
J_A21 N026 N011 0 DR
R43 VDD N026 50k
J_A22 VDD N026 P019 DR
R44 P019 N012 1k
R45 VSS N012 4.5k
J_A23 N030 N011 0 DR
R46 VDD N030 50k
J_A24 VDD N030 P020 DR
R47 P020 N012 1k
R48 VSS N012 4.5k
J_A25 N019 N013 0 DR
R49 VDD N019 50k
J_A26 VDD N019 P021 DR
R50 P021 N014 1k
R51 VSS N014 4.5k
J_A27 N023 N013 0 DR
R52 VDD N023 50k
J_A28 VDD N023 P022 DR
R53 P022 N014 1k
R54 VSS N014 4.5k
J_A29 N027 N013 0 DR
R55 VDD N027 50k
J_A30 VDD N027 P023 DR
R56 P023 N014 1k
R57 VSS N014 4.5k
J_A31 N031 N013 0 DR
R58 VDD N031 50k
J_A32 VDD N031 P024 DR
R59 P024 N014 1k
R60 VSS N014 4.5k
J_A33 N020 N015 0 DR
R61 VDD N020 50k
J_A34 VDD N020 P025 DR
R62 P025 N016 1k
R63 VSS N016 4.5k
J_A35 N024 N015 0 DR
R64 VDD N024 50k
J_A36 VDD N024 P026 DR
R65 P026 N016 1k
R66 VSS N016 4.5k
J_A37 N028 N015 0 DR
R67 VDD N028 50k
J_A38 VDD N028 P027 DR
R68 P027 N016 1k
R69 VSS N016 4.5k
J_A39 N032 N015 0 DR
R70 VDD N032 50k
J_A40 VDD N032 P028 DR
R71 P028 N016 1k
R72 VSS N016 4.5k
.model NJF NJF
.model PJF PJF
.lib standard.jft
.backanno
.end